# Altium schematic sheet Filter_Pi.SchDoc: Filter PI
size A4; CompanyName: github.com/aKaReZa75; Revision: 1.0; SheetNumber: 1; SheetTotal: 1; Project_name: Design Template
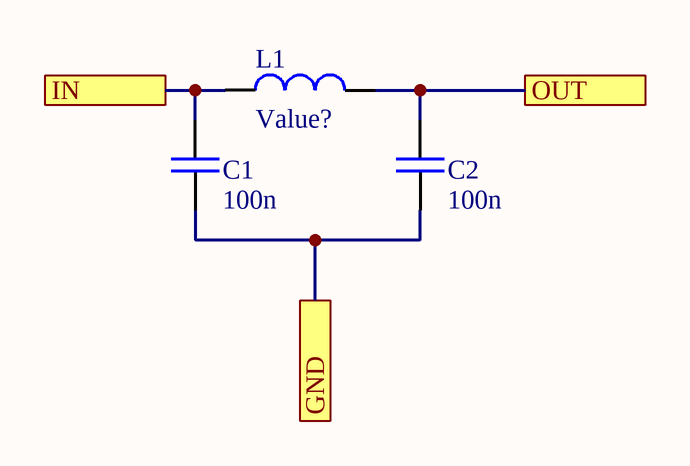
[diagram p0: Filter_Pi.SchDoc]

## Parts
C1  100n  [CAP 0805/2012]
C2  100n  [CAP 0805/2012]
L1  Value?  [IND0805]

## Ports
GND, IN, OUT

## Nets
GND: C1.2 C2.2 ; port GND
IN: C1.1 L1.1 ; port IN
OUT: C2.1 L1.2 ; port OUT

## Notes on the sheet
- Title:
- Project:
- Drawn by:
- Revision:
- Hossein Bagheri
- Company:
- Sheet
- of

## Library data of the parts
C1 C2 = Cap_Multi_SMD_100nF_0805: Bipolar ceramic capacitor SMD; Inflow: inflow?; Type: MultiLayer; Rating: 50V; Validation: Valid; Package: 0805; Value: 100n
L1 = Ind_SMD_0805: Inductor; Inflow: inflow?; Type: SMD; Rating: Rating?; Validation: Valid; Package: 0805; Value: Value?